# Altium schematic sheet WS2812.SchDoc
size A; SheetNumber: 6; SheetTotal: 6
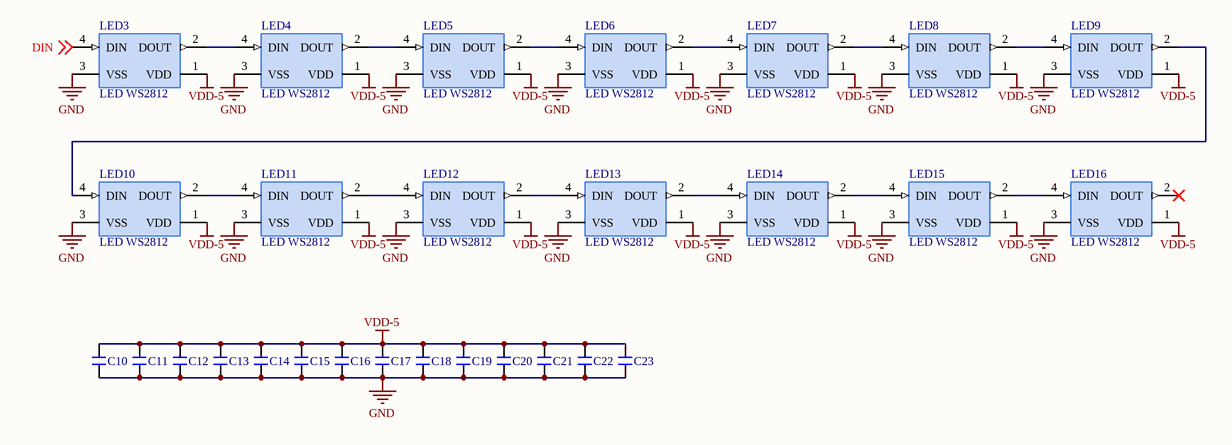
[diagram p0: WS2812.SchDoc]

## Parts
C10  (no value)  [C 0805]
C11  (no value)  [C 0805]
C12  (no value)  [C 0805]
C13  (no value)  [C 0805]
C14  (no value)  [C 0805]
C15  (no value)  [C 0805]
C16  (no value)  [C 0805]
C17  (no value)  [C 0805]
C18  (no value)  [C 0805]
C19  (no value)  [C 0805]
C20  (no value)  [C 0805]
C21  (no value)  [C 0805]
C22  (no value)  [C 0805]
C23  (no value)  [C 0805]
LED3  LED WS2812  [LED WS2812 (5050)]
LED4  LED WS2812  [LED WS2812 (5050)]
LED5  LED WS2812  [LED WS2812 (5050)]
LED6  LED WS2812  [LED WS2812 (5050)]
LED7  LED WS2812  [LED WS2812 (5050)]
LED8  LED WS2812  [LED WS2812 (5050)]
LED9  LED WS2812  [LED WS2812 (5050)]
LED10  LED WS2812  [LED WS2812 (5050)]
LED11  LED WS2812  [LED WS2812 (5050)]
LED12  LED WS2812  [LED WS2812 (5050)]
LED13  LED WS2812  [LED WS2812 (5050)]
LED14  LED WS2812  [LED WS2812 (5050)]
LED15  LED WS2812  [LED WS2812 (5050)]
LED16  LED WS2812  [LED WS2812 (5050)]

## Nets
GND: C10.1 C11.1 C12.1 C13.1 C14.1 C15.1 C16.1 C17.1 C18.1 C19.1 C20.1 C21.1 C22.1 C23.1 LED3.3(VSS) LED4.3(VSS) LED5.3(VSS) LED6.3(VSS) LED7.3(VSS) LED8.3(VSS) LED9.3(VSS) LED10.3(VSS) LED11.3(VSS) LED12.3(VSS) LED13.3(VSS) LED14.3(VSS) LED15.3(VSS) LED16.3(VSS)
VDD-5: C10.2 C11.2 C12.2 C13.2 C14.2 C15.2 C16.2 C17.2 C18.2 C19.2 C20.2 C21.2 C22.2 C23.2 LED3.1(VDD) LED4.1(VDD) LED5.1(VDD) LED6.1(VDD) LED7.1(VDD) LED8.1(VDD) LED9.1(VDD) LED10.1(VDD) LED11.1(VDD) LED12.1(VDD) LED13.1(VDD) LED14.1(VDD) LED15.1(VDD) LED16.1(VDD)
DIN: LED3.4(DIN) ; off-sheet DIN
NetLED3_2: LED3.2(DOUT) LED4.4(DIN)
NetLED4_2: LED4.2(DOUT) LED5.4(DIN)
NetLED5_2: LED5.2(DOUT) LED6.4(DIN)
NetLED6_2: LED6.2(DOUT) LED7.4(DIN)
NetLED7_2: LED7.2(DOUT) LED8.4(DIN)
NetLED8_2: LED8.2(DOUT) LED9.4(DIN)
NetLED9_2: LED9.2(DOUT) LED10.4(DIN)
NetLED10_2: LED10.2(DOUT) LED11.4(DIN)
NetLED11_2: LED11.2(DOUT) LED12.4(DIN)
NetLED12_2: LED12.2(DOUT) LED13.4(DIN)
NetLED13_2: LED13.2(DOUT) LED14.4(DIN)
NetLED14_2: LED14.2(DOUT) LED15.4(DIN)
NetLED15_2: LED15.2(DOUT) LED16.4(DIN)

Not connected (* = marked no-connect by the designer): LED16 2(DOUT)*

## Library data of the parts
C10-C23 = C: Non-polar patch capacitor; BOM名称: 无极性贴片电容; 版权归属: 源创客; 学习资源: www.ooocke.com